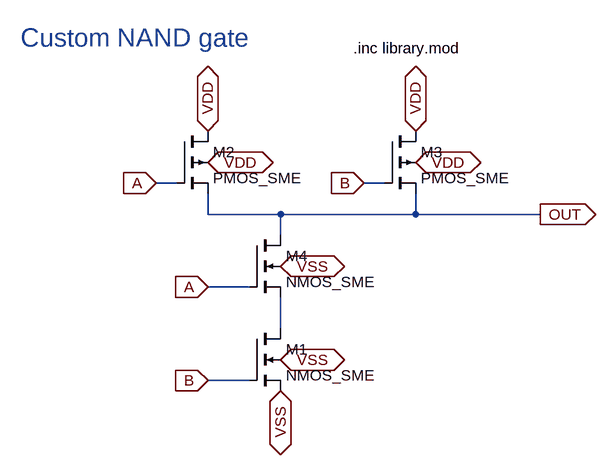
[diagram p0: schematic my_nand.asc]
my_nand.asc, the LTspice schematic file:
Version 4.1
SHEET 1 880 716
WIRE 128 272 96 272
WIRE 448 272 416 272
WIRE 176 320 176 288
WIRE 288 320 176 320
WIRE 496 320 496 288
WIRE 496 320 288 320
WIRE 688 320 496 320
WIRE 288 352 288 320
WIRE 240 432 176 432
WIRE 288 496 288 448
WIRE 240 576 176 576
FLAG 96 272 A
IOPIN 96 272 In
FLAG 176 432 A
IOPIN 176 432 In
FLAG 416 272 B
IOPIN 416 272 In
FLAG 176 576 B
IOPIN 176 576 In
FLAG 176 192 VDD
IOPIN 176 192 BiDir
FLAG 176 240 VDD
IOPIN 176 240 BiDir
FLAG 496 192 VDD
IOPIN 496 192 BiDir
FLAG 496 240 VDD
IOPIN 496 240 BiDir
FLAG 288 592 VSS
IOPIN 288 592 BiDir
FLAG 288 544 VSS
IOPIN 288 544 BiDir
FLAG 288 400 VSS
IOPIN 288 400 BiDir
FLAG 688 320 OUT
IOPIN 688 320 Out
SYMBOL nmos4 240 496 R0
SYMATTR InstName M1
SYMATTR Value NMOS_SME
SYMATTR Value2 l=0.35u w=0.4u
SYMBOL pmos4 128 192 R0
SYMATTR InstName M2
SYMATTR Value PMOS_SME
SYMATTR Value2 l=0.35u w=0.4u
SYMBOL pmos4 448 192 R0
SYMATTR InstName M3
SYMATTR Value PMOS_SME
SYMATTR Value2 l=0.35u w=0.4u
SYMBOL nmos4 240 352 R0
SYMATTR InstName M4
SYMATTR Value NMOS_SME
SYMATTR Value2 l=0.35u w=0.4u
TEXT -112 48 Left 4 ;Custom NAND gate
TEXT 400 64 Left 2 !.inc library.mod

The netlist it stands for:
* my_nand.asc
M1 N001 B VSS VSS NMOS_SME l=0.35u w=0.4u
M2 VDD A OUT VDD PMOS_SME l=0.35u w=0.4u
M3 VDD B OUT VDD PMOS_SME l=0.35u w=0.4u
M4 OUT A N001 VSS NMOS_SME l=0.35u w=0.4u
.model NMOS NMOS
.model PMOS PMOS
.lib standard.mos
* Custom NAND gate
.inc library.mod
.backanno
.end